# EAGLE board CFT-PB3 (EAGLE 5.11)
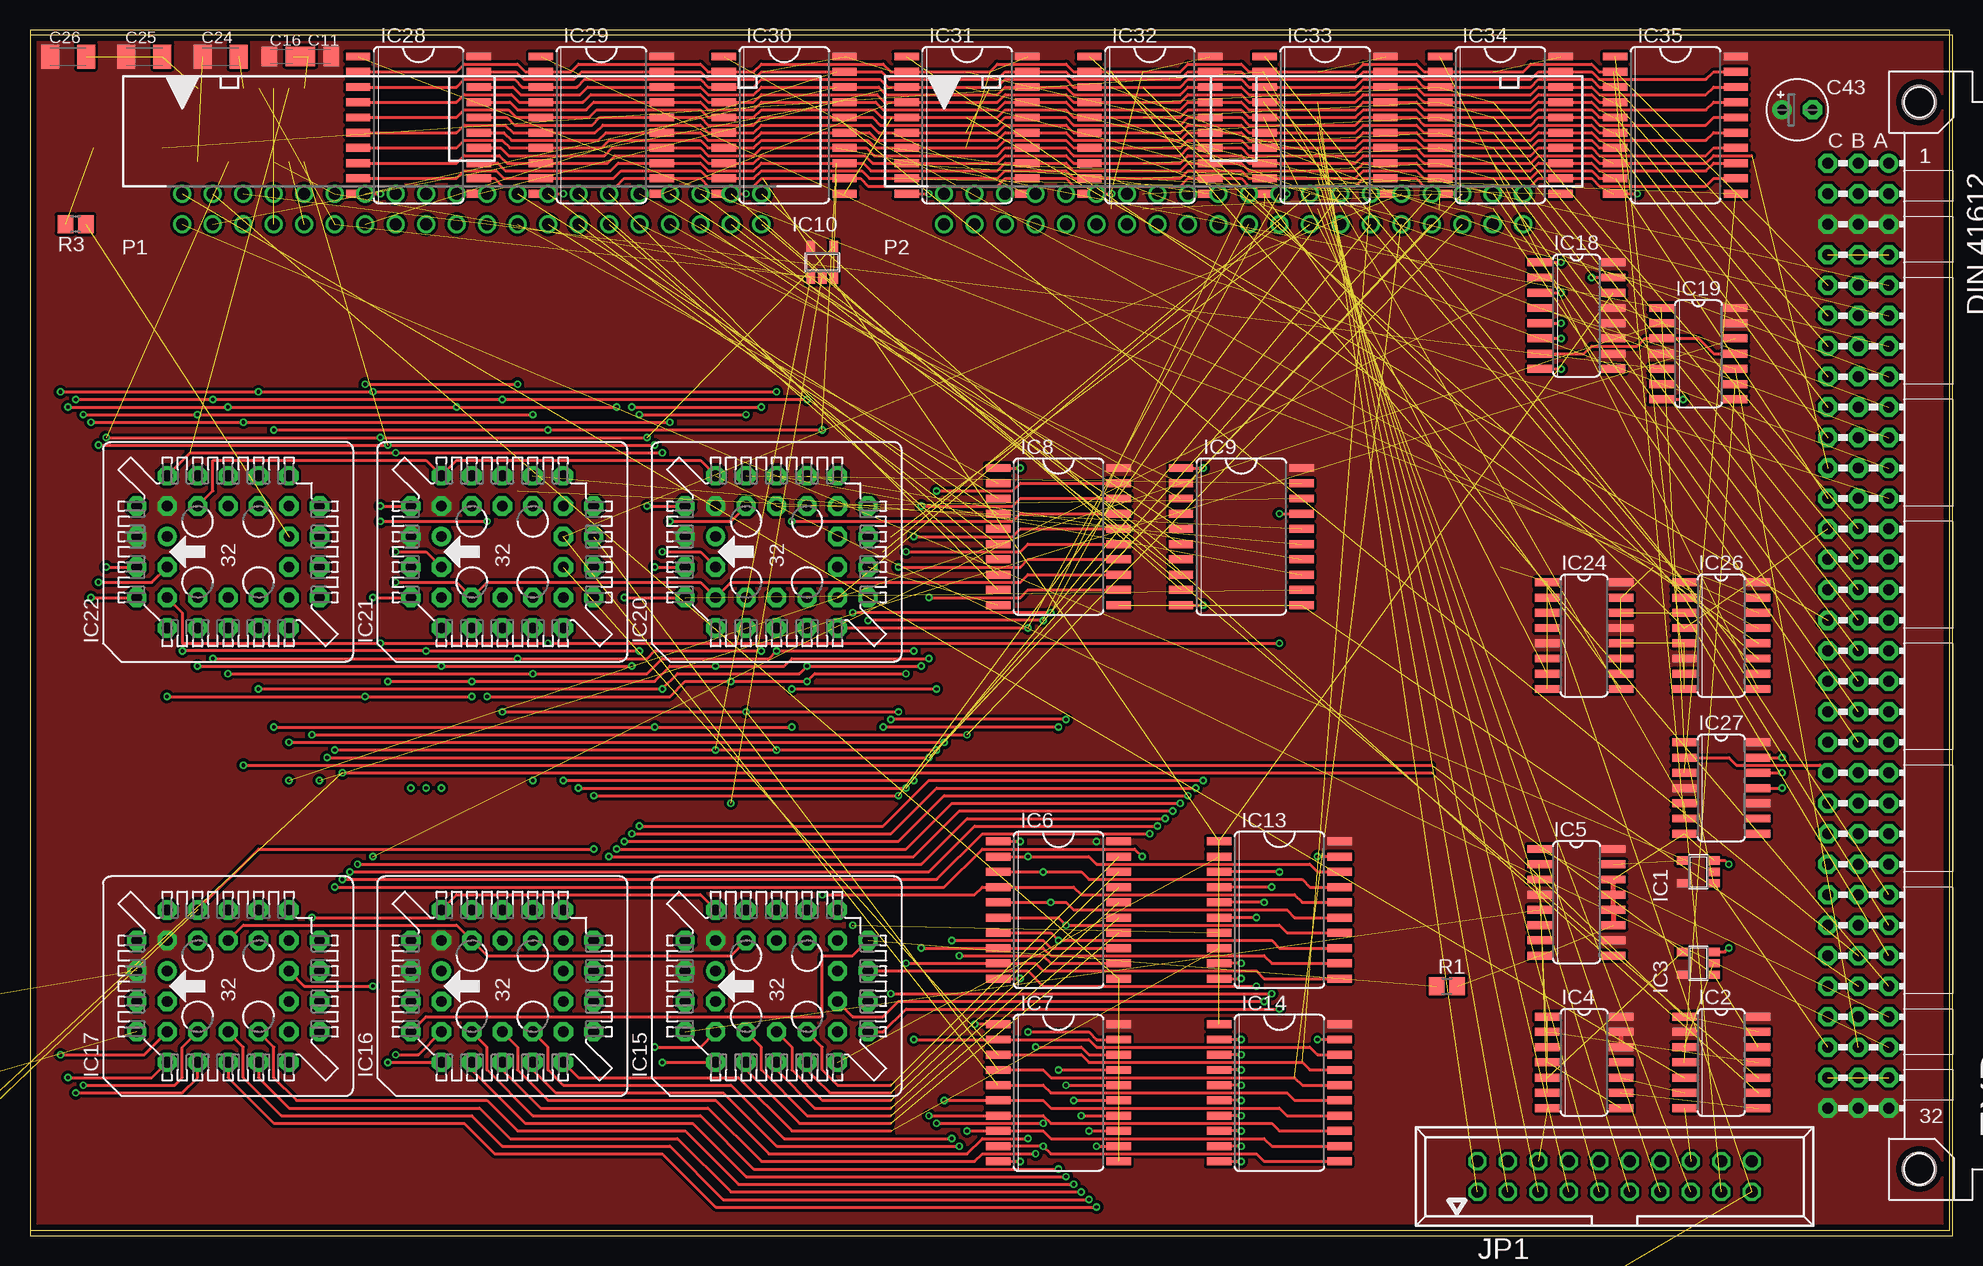
[diagram p8: board, top side]
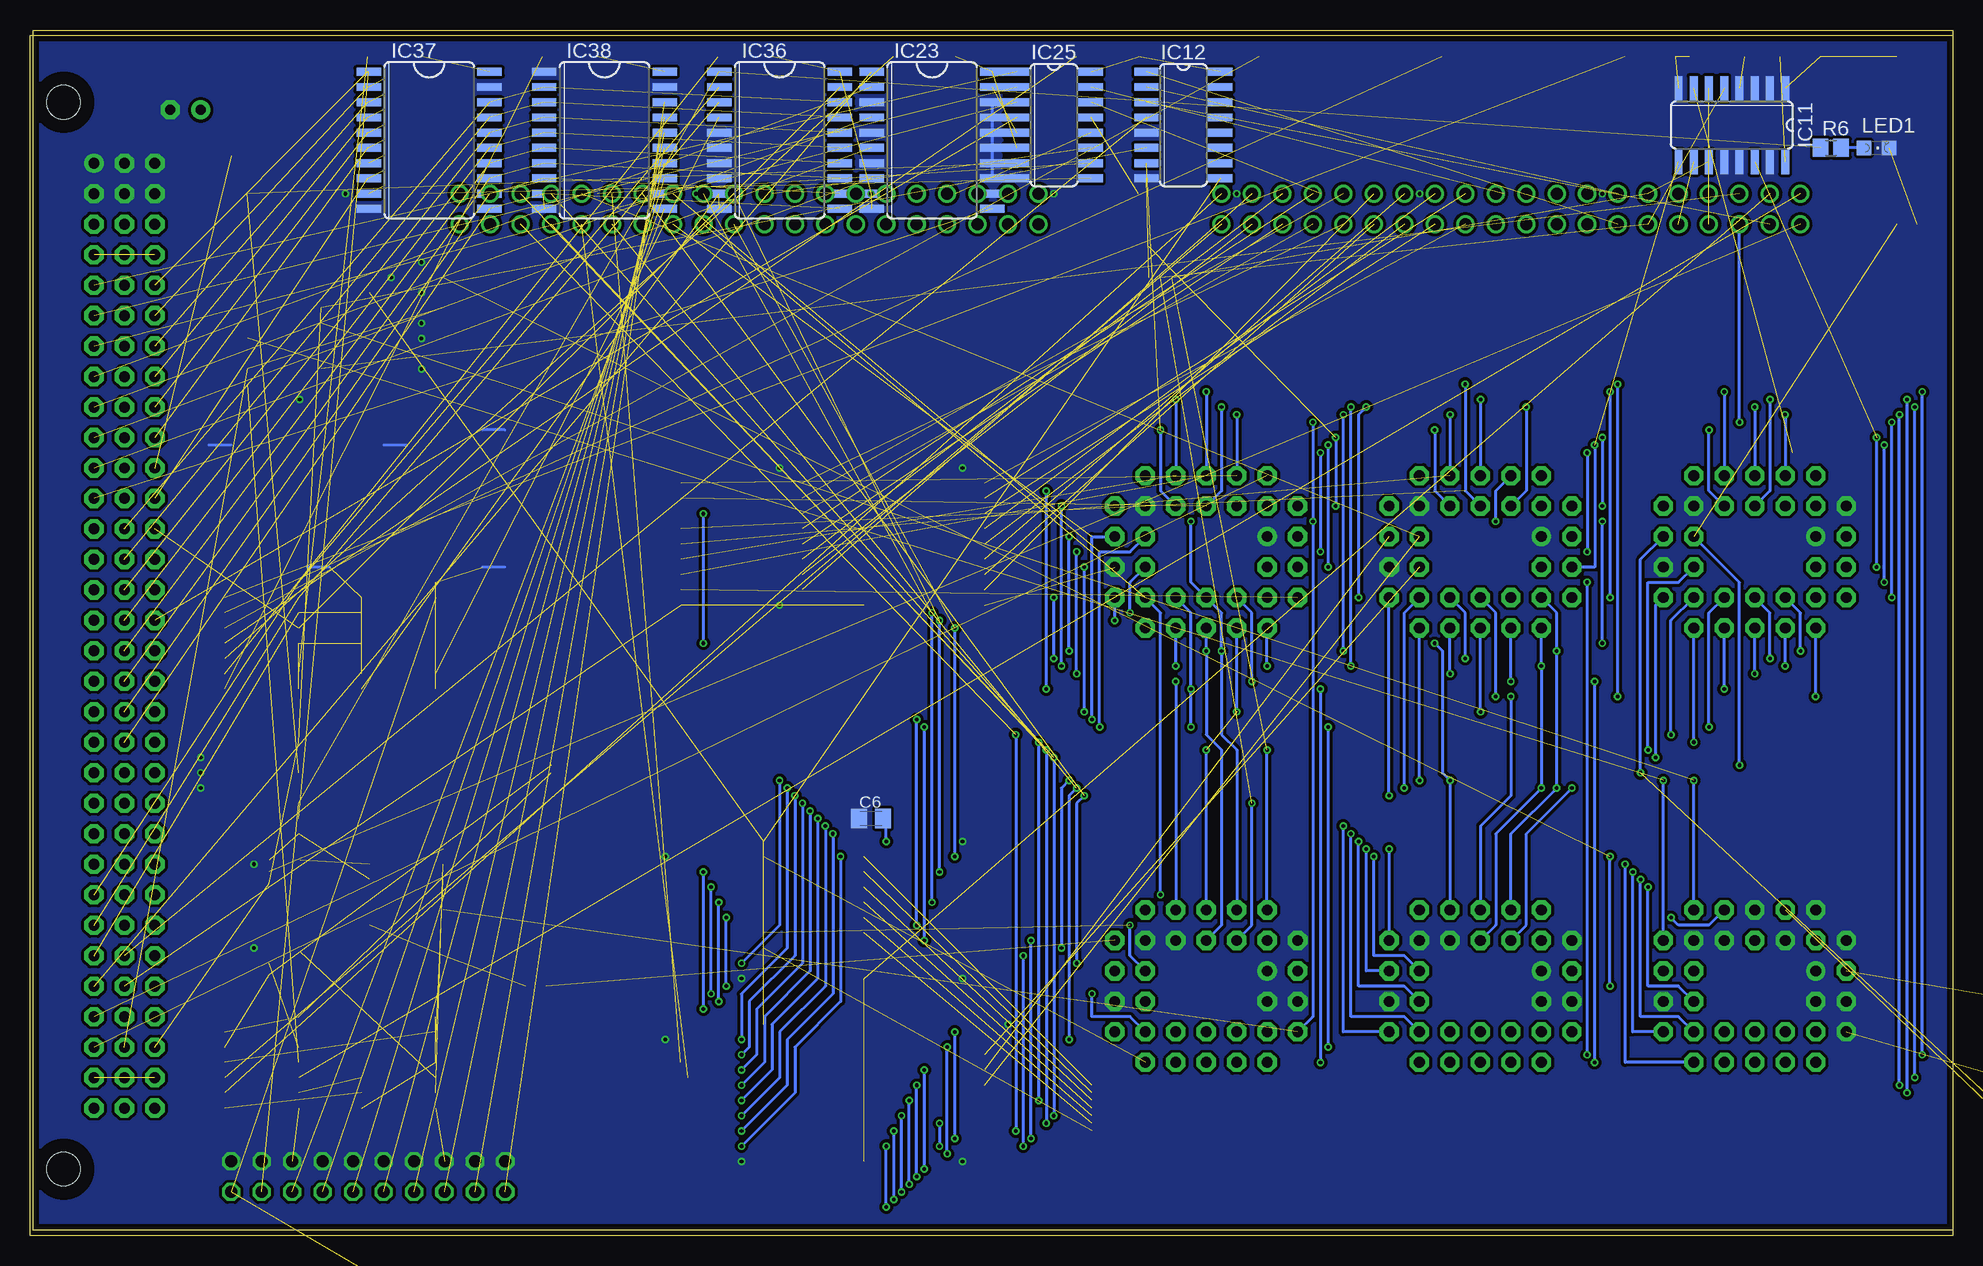
[diagram p9: board, bottom side, seen from below]

Size 160 x 100 mm. Coordinates in mm from the lower left corner, seen from the top.
Outline: 0,0 160,0 160,100 0,100 0,0
Copper layers (1*16): Top 0.035mm / dielectric 1.5mm / Bottom 0.035mm
Design rules "smart-prototyping": minimum track width 7mil, minimum drill 12mil, track to track 7mil, track to pad 7mil, pad to pad 7mil, via to via 7mil, smd to smd 0mil, copper to edge 20mil, drill to drill 10mil, minimum pad ring 10mil, minimum via ring 6mil, stop-mask expansion 2mil, vias tented up to drill 25mil, thermal gap 10mil
Net classes: 0 default: width 0.152 mm, clearance 0.152 mm; 1 low power: width 1.27 mm, clearance 0.254 mm; 2 LED power: width 1.93 mm, clearance 0.254 mm

## Footprints (pad centres in the part's own frame; a part is rotated, then mirrored left to right if it is on the bottom)
C0805K = smd 1.3 x 1.6: 1 -1,0; 2 1,0
C1206K = smd 1.5 x 2: 1 -1.5,0; 2 1.5,0
E2,5-5 = drill 0.813 pad 1.6 round: + -1.27,0 | drill 0.813 pad 1.6 octagon: - 1.27,0
VG96K = drill 0.914 pad 1.6 round: A1 154.94,39.37 | drill 0.914 pad 1.6 octagon: A2 154.94,36.83; A3 154.94,34.29; A4 154.94,31.75; A5 154.94,29.21; A6 154.94,26.67; A7 154.94,24.13; A8 154.94,21.59; A9 154.94,19.05; A10 154.94,16.51; A11 154.94,13.97; A12 154.94,11.43; A13 154.94,8.89; A14 154.94,6.35; A15 154.94,3.81; A16 154.94,1.27; A17 154.94,-1.27; A18 154.94,-3.81; A19 154.94,-6.35; A20 154.94,-8.89; A21 154.94,-11.43; A22 154.94,-13.97; A23 154.94,-16.51; A24 154.94,-19.05; A25 154.94,-21.59; A26 154.94,-24.13; A27 154.94,-26.67; A28 154.94,-29.21; A29 154.94,-31.75; A30 154.94,-34.29; A31 154.94,-36.83; A32 154.94,-39.37; B1 152.4,39.37; B2 152.4,36.83; B3 152.4,34.29; B4 152.4,31.75; B5 152.4,29.21; B6 152.4,26.67; B7 152.4,24.13; B8 152.4,21.59; B9 152.4,19.05; B10 152.4,16.51; B11 152.4,13.97; B12 152.4,11.43; B13 152.4,8.89; B14 152.4,6.35; B15 152.4,3.81; B16 152.4,1.27; B17 152.4,-1.27; B18 152.4,-3.81; B19 152.4,-6.35; B20 152.4,-8.89; B21 152.4,-11.43; B22 152.4,-13.97; B23 152.4,-16.51; B24 152.4,-19.05; B25 152.4,-21.59; B26 152.4,-24.13; B27 152.4,-26.67; B28 152.4,-29.21; B29 152.4,-31.75; B30 152.4,-34.29; B31 152.4,-36.83; B32 152.4,-39.37; C1 149.86,39.37; C2 149.86,36.83; C3 149.86,34.29; C4 149.86,31.75; C5 149.86,29.21; C6 149.86,26.67; C7 149.86,24.13; C8 149.86,21.59; C9 149.86,19.05; C10 149.86,16.51; C11 149.86,13.97; C12 149.86,11.43; C13 149.86,8.89; C14 149.86,6.35; C15 149.86,3.81; C16 149.86,1.27; C17 149.86,-1.27; C18 149.86,-3.81; C19 149.86,-6.35; C20 149.86,-8.89; C21 149.86,-11.43; C22 149.86,-13.97; C23 149.86,-16.51; C24 149.86,-19.05; C25 149.86,-21.59; C26 149.86,-24.13; C27 149.86,-26.67; C28 149.86,-29.21; C29 149.86,-31.75; C30 149.86,-34.29; C31 149.86,-36.83; C32 149.86,-39.37 | hole 2.794: 157.48,44.45; 157.48,-44.45
SOT23-5 = smd 0.69 x 0.99: 1 -0.95,-1.29; 2 0,-1.29; 3 0.95,-1.29; 4 0.95,1.3; 5 -0.95,1.3
SO14 = smd 0.66 x 2.032: 1 -3.81,-3.073; 2 -2.54,-3.073; 3 -1.27,-3.073; 4 0,-3.073; 5 1.27,-3.073; 6 2.54,-3.073; 7 3.81,-3.073; 8 3.81,3.073; 9 2.54,3.073; 10 1.27,3.073; 11 0,3.073; 12 -1.27,3.073; 13 -2.54,3.073; 14 -3.81,3.073
SO16 = smd 0.66 x 2.032: 1 -4.445,-3.073; 2 -3.175,-3.073; 3 -1.905,-3.073; 4 -0.635,-3.073; 5 0.635,-3.073; 6 1.905,-3.073; 7 3.175,-3.073; 8 4.445,-3.073; 9 4.445,3.073; 10 3.175,3.073; 11 1.905,3.073; 12 0.635,3.073; 13 -0.635,3.073; 14 -1.905,3.073; 15 -3.175,3.073; 16 -4.445,3.073
SO20W = smd 0.66 x 2.032: 1 -5.715,-5.029; 2 -4.445,-5.029; 3 -3.175,-5.029; 4 -1.905,-5.029; 5 -0.635,-5.029; 6 0.635,-5.029; 7 1.905,-5.029; 8 3.175,-5.029; 9 4.445,-5.029; 10 5.715,-5.029; 11 5.715,5.029; 12 4.445,5.029; 13 3.175,5.029; 14 1.905,5.029; 15 0.635,5.029; 16 -0.635,5.029; 17 -1.905,5.029; 18 -3.175,5.029; 19 -4.445,5.029; 20 -5.715,5.029
PLCC32 = drill 0.9 pad 1.6 round: 1 1.27,5.08 | drill 0.9 pad 1.6 octagon: 2 -1.27,7.62; 3 -1.27,5.08; 4 -3.81,7.62; 5 -6.35,5.08; 6 -3.81,5.08; 7 -6.35,2.54; 8 -3.81,2.54; 9 -6.35,0; 10 -3.81,0; 11 -6.35,-2.54; 12 -3.81,-2.54; 13 -6.35,-5.08; 14 -3.81,-7.62; 15 -3.81,-5.08; 16 -1.27,-7.62; 17 -1.27,-5.08; 18 1.27,-7.62; 19 1.27,-5.08; 20 3.81,-7.62; 21 6.35,-5.08; 22 3.81,-5.08; 23 6.35,-2.54; 24 3.81,-2.54; 25 6.35,0; 26 3.81,0; 27 6.35,2.54; 28 3.81,2.54; 29 6.35,5.08; 30 3.81,7.62; 31 3.81,5.08; 32 1.27,7.62
057-020-1 = drill 1 octagon: 1 -11.43,-1.27; 2 -11.43,1.27; 3 -8.89,-1.27; 4 -8.89,1.27; 5 -6.35,-1.27; 6 -6.35,1.27; 7 -3.81,-1.27; 8 -3.81,1.27; 9 -1.27,-1.27; 10 -1.27,1.27; 11 1.27,-1.27; 12 1.27,1.27; 13 3.81,-1.27; 14 3.81,1.27; 15 6.35,-1.27; 16 6.35,1.27; 17 8.89,-1.27; 18 8.89,1.27; 19 11.43,-1.27; 20 11.43,1.27
CHIPLED_0805 = smd 1.2 x 1.2: A 0,-1.05; C 0,1.05
PAK100/2500-5-40 = drill 1 pad 1.422 round: 1 -24.13,-1.27; 2 -24.13,1.27; 3 -21.59,-1.27; 4 -21.59,1.27; 5 -19.05,-1.27; 6 -19.05,1.27; 7 -16.51,-1.27; 8 -16.51,1.27; 9 -13.97,-1.27; 10 -13.97,1.27; 11 -11.43,-1.27; 12 -11.43,1.27; 13 -8.89,-1.27; 14 -8.89,1.27; 15 -6.35,-1.27; 16 -6.35,1.27; 17 -3.81,-1.27; 18 -3.81,1.27; 19 -1.27,-1.27; 20 -1.27,1.27; 21 1.27,-1.27; 22 1.27,1.27; 23 3.81,-1.27; 24 3.81,1.27; 25 6.35,-1.27; 26 6.35,1.27; 27 8.89,-1.27; 28 8.89,1.27; 29 11.43,-1.27; 30 11.43,1.27; 31 13.97,-1.27; 32 13.97,1.27; 33 16.51,-1.27; 34 16.51,1.27; 35 19.05,-1.27; 36 19.05,1.27; 37 21.59,-1.27; 38 21.59,1.27; 39 24.13,-1.27; 40 24.13,1.27
R0805 = smd 1.3 x 1.5: 1 -0.85,0; 2 0.85,0

## Placement (x,y rotation side)
$4_37_$  SIGNATURESILK  [SIGNATURE]  -228.6,-204.47 0 top  (outside the outline)
$4_39_$  OSHW-LOGOL  [OSHW-LOGO-L]  -215.26,-200.03 0 top  (outside the outline)
$4_39_$1  OSHW-LOGOL  [OSHW-LOGO-L]  -207.01,-200.03 0 top  (outside the outline)
$4_40_$  QRCODE-CFT  [CFT-QRCODE]  -228.6,-160.66 0 top  (outside the outline)
C1  0.1uF  [C0805K]  -217.81,-123.19 0 top  (outside the outline)
C2  0.1uF  [C0805K]  -211.46,-123.19 0 top  (outside the outline)
C3  0.1uF  [C0805K]  -217.81,-128.27 0 top  (outside the outline)
C4  0.1uF  [C0805K]  -211.46,-128.27 0 top  (outside the outline)
C5  1uF  [C0805K]  -217.81,-133.35 0 top  (outside the outline)
C6  0.1uF  [C0805K]  90.17,34.29 0 bottom
C7  0.1uF  [C0805K]  -217.81,-113.03 0 top  (outside the outline)
C8  0.1uF  [C0805K]  -211.46,-113.03 0 top  (outside the outline)
C9  0.1uF  [C0805K]  -217.81,-118.11 0 top  (outside the outline)
C10  1uF  [C0805K]  -211.46,-118.11 0 top  (outside the outline)
C11  0.1uF  [C0805K]  24.13,97.79 0 top
C12  0.1uF  [C0805K]  -216.53,-16.51 0 top  (outside the outline)
C13  0.1uF  [C0805K]  -215.9,-21.59 0 top  (outside the outline)
C14  0.1uF  [C0805K]  -215.9,-26.67 0 top  (outside the outline)
C15  0.1uF  [C0805K]  -217.17,-31.75 0 top  (outside the outline)
C16  1uF  [C0805K]  20.95,97.79 0 top
C17  1uF  [C1206K]  -217.81,-138.43 0 top  (outside the outline)
C18  1uF  [C1206K]  -222.88,-138.43 0 top  (outside the outline)
C19  1uF  [C1206K]  -227.97,-139.06 0 top  (outside the outline)
C20  0.1uF  [C0805K]  -217.17,-41.91 0 top  (outside the outline)
C21  0.1uF  [C0805K]  -210.82,-41.91 0 top  (outside the outline)
C22  0.1uF  [C0805K]  -217.17,-46.99 0 top  (outside the outline)
C23  1uF  [C0805K]  -210.82,-46.99 0 top  (outside the outline)
C24  1uF  [C1206K]  15.88,97.79 0 top
C25  1uF  [C1206K]  9.53,97.79 0 top
C26  1uF  [C1206K]  3.17,97.79 0 top
C27  0.1uF  [C0805K]  -217.81,-102.87 0 top  (outside the outline)
C28  0.1uF  [C0805K]  -216.53,-82.55 0 top  (outside the outline)
C29  0.1uF  [C0805K]  -217.17,-87.63 0 top  (outside the outline)
C30  0.1uF  [C0805K]  -217.17,-92.71 0 top  (outside the outline)
C31  0.1uF  [C0805K]  -217.17,-97.79 0 top  (outside the outline)
C32  0.1uF  [C0805K]  -216.53,-67.31 0 top  (outside the outline)
C33  0.1uF  [C0805K]  -210.82,-67.31 0 top  (outside the outline)
C34  0.1uF  [C0805K]  -217.17,-72.39 0 top  (outside the outline)
C35  0.1uF  [C0805K]  -210.82,-72.39 0 top  (outside the outline)
C36  0.1uF  [C0805K]  -217.17,-77.47 0 top  (outside the outline)
C37  0.1uF  [C0805K]  -217.17,-52.07 0 top  (outside the outline)
C38  0.1uF  [C0805K]  -210.82,-52.07 0 top  (outside the outline)
C39  0.1uF  [C0805K]  -217.17,-57.15 0 top  (outside the outline)
C40  0.1uF  [C0805K]  -210.82,-57.15 0 top  (outside the outline)
C41  0.1uF  [C0805K]  -217.17,-62.23 0 top  (outside the outline)
C42  1uF  [C0805K]  -210.82,-62.23 0 top  (outside the outline)
C43  1uF  [E2,5-5]  147.32,93.34 0 top
EXP  [VG96K]  0,49.53 0 top
IC1  74AHC1G08DBV  [SOT23-5]  139.06,29.84 90 top
IC2  74HC00D  [SO14]  140.97,13.97 270 top
IC3  74AHC1G08DBV  [SOT23-5]  139.06,22.23 90 top
IC4  74HC32D  [SO14]  129.54,13.97 270 top
IC5  74HC112D  [SO16]  128.91,27.3 270 top
IC6  74HC574D  [SO20W]  85.72,26.67 270 top
IC7  74HC574D  [SO20W]  85.72,11.43 270 top
IC8  74HC574D  [SO20W]  85.72,57.78 270 top
IC9  74HC574D  [SO20W]  100.97,57.78 270 top
IC10  74AHC1G32DBV  [SOT23-5]  66.04,80.64 0 top
IC11  74HC253D  [SO16]  18.41,92.08 180 bottom
IC12  74HC138D  [SO16]  64.14,92.08 270 bottom
IC13  74HC541DW  [SO20W]  104.14,26.67 270 top
IC14  74HC541DW  [SO20W]  104.14,11.43 270 top
IC15  29F040  [PLCC32]  62.23,20.32 90 top
IC16  29F040  [PLCC32]  39.37,20.32 90 top
IC17  29F040  [PLCC32]  16.51,20.32 90 top
IC18  74HC253D  [SO16]  128.91,76.2 270 top
IC19  74HC74D  [SO14]  139.06,73.03 270 top
IC20  29F040  [PLCC32]  62.23,56.52 90 top
IC21  29F040  [PLCC32]  39.37,56.52 90 top
IC22  29F040  [PLCC32]  16.51,56.52 90 top
IC23  74HC688DW  [SO20W]  85.09,90.81 270 bottom
IC24  74HC253D  [SO16]  129.54,49.53 270 top
IC25  74HC138D  [SO16]  74.93,92.08 270 bottom
IC26  74HC138D  [SO16]  140.97,49.53 270 top
IC27  74HC74D  [SO14]  140.97,36.83 270 top
IC28  74HC574D  [SO20W]  32.38,92.08 270 top
IC29  74HC574D  [SO20W]  47.62,92.08 270 top
IC30  74HC574D  [SO20W]  62.87,92.08 270 top
IC31  74HC574D  [SO20W]  78.11,92.08 270 top
IC32  74HC574D  [SO20W]  93.34,92.08 270 top
IC33  74HC574D  [SO20W]  107.95,92.08 270 top
IC34  74HC574D  [SO20W]  122.56,92.08 270 top
IC35  74HC574D  [SO20W]  137.16,92.08 270 top
IC36  74HC541DW  [SO20W]  97.79,90.81 270 bottom
IC37  74HC541DW  [SO20W]  127,90.81 270 bottom
IC38  74HC541DW  [SO20W]  112.39,90.81 270 bottom
JP1  057-020-1  [057-020-1]  132.08,4.45 0 top
LED1  LED-5MM-GREEN  [CHIPLED_0805]  6.35,90.17 270 bottom
P1  2540-5  [PAK100/2500-5-40]  36.83,85.09 0 top
P2  2540-5  [PAK100/2500-5-40]  100.33,85.09 0 top
R1  4k7  [R0805]  118.11,20.32 0 top
R2  4k7  [R0805]  -233.04,-217.17 0 top  (outside the outline)
R3  4k7  [R0805]  3.81,83.82 180 top
R4  4k7  [R0805]  -233.04,-203.2 0 top  (outside the outline)
R6  330R  [R0805]  10.16,90.17 0 bottom
R7  4k7  [R0805]  -233.04,-210.19 0 top  (outside the outline)

## Tracks (layer width: path | path; a pad name or v marks a point on that pad's centre or on a via)
!ALUCPL  (via drill 0.3)  (1 unrouted)
  Bottom 0.254: IC17.20 v24.13,37.47
!BANKING  (1 unrouted)
!BANKR0  (1 unrouted)
!BANKR1  (1 unrouted)
!BANKR2  (1 unrouted)
!BANKR3  (1 unrouted)
!BANKR4  (1 unrouted)
!BANKR5  (1 unrouted)
!BANKR6  (1 unrouted)
!BANKR7  (1 unrouted)
!BANKW0  (1 unrouted)
!BANKW1  (1 unrouted)
!BANKW2  (1 unrouted)
!BANKW3  (1 unrouted)
!BANKW4  (1 unrouted)
!BANKW5  (1 unrouted)
!BANKW6  (1 unrouted)
!BANKW7  (2 unrouted)
!BOE  (3 unrouted)
!CLL  (1 unrouted)
!CPL  (1 unrouted)
!DECCPL  (1 unrouted)
!FLTADD  (1 unrouted)
!FPRAM  (2 unrouted)
!INCCPL  (1 unrouted)
!IRQS  (1 unrouted)
  Top 0.254: IC20.29 55.88,64.14 35.56,64.14 IC21.29 33.02,64.14 15.24,64.14 15.24,61.59 IC22.28
!LCLR  (1 unrouted)
!MBUSEL  (1 unrouted)
!MEM  (2 unrouted)
!RESET  (4 unrouted)
!RSTHOLD  (1 unrouted)
!SYSDEV  (1 unrouted)
!T34  (1 unrouted)
!UOE  (via drill 0.3)  (1 unrouted)
  Top 0.254: v20.32,66.67 v43.18,66.67 v66.04,66.67
  Bottom 0.254: v20.32,66.67 20.32,61.59 IC22.24 | IC21.24 43.18,61.59 v43.18,66.67 | v66.04,66.67 66.04,61.59 IC20.24
!W  (1 unrouted)
!WALU  (2 unrouted)
+3.3V  (2 unrouted)
+12V  (2 unrouted)
A0  (via drill 0.3)
  Top 0.254: IC15.6 55.88,15.24 v52.07,15.24 | v63.5,41.91 v52.07,41.91 v20.32,41.91 | IC8.19 82.55,62.23 81.92,61.59 v75.56,61.59 | v63.5,45.09 v75.56,45.09
  Bottom 0.254: v52.07,41.91 v52.07,15.24 | v63.5,41.91 v63.5,45.09 63.5,51.44 IC20.12 | IC22.12 20.32,51.44 v20.32,41.91 | v75.56,45.09 v75.56,61.59
A1  (via drill 0.3)
  Top 0.254: v52.7,13.97 IC15.5 | v19.05,45.09 v52.7,45.09 53.98,46.35 64.14,46.35 v64.77,46.99 v74.3,46.99 | IC8.18 82.55,60.96 81.92,60.33 v74.3,60.33
  Bottom 0.254: v19.05,45.09 IC22.11 | v64.77,46.99 IC20.11 | v52.7,45.09 v52.7,13.97 | v74.3,46.99 v74.3,60.33
A2  (via drill 0.3)
  Top 0.254: v15.24,47.62 v40.64,47.62 51.44,47.62 52.07,48.26 v60.96,48.26 | IC8.17 82.55,59.69 81.92,59.05 v63.5,59.05
  Bottom 0.254: IC15.27 59.69,40.01 60.96,41.27 v60.96,48.26 60.96,51.44 IC20.10 63.5,53.98 v63.5,59.05 | v15.24,47.62 15.24,51.44 IC22.10 | IC21.12 40.64,51.44 v40.64,47.62
A3  (via drill 0.3)
  Top 0.254: v16.51,46.35 v41.91,46.35 51.44,46.35 52.7,47.62 61.59,47.62 v62.23,48.26 v73.66,48.26 | IC8.16 82.55,58.42 81.92,57.78 v73.66,57.78
  Bottom 0.254: IC15.26 60.96,25.4 60.96,40.01 62.23,41.27 v62.23,48.26 IC20.9 | v16.51,46.35 IC22.9 | v41.91,46.35 IC21.11 | v73.66,48.26 v73.66,57.78
A4  (via drill 0.3)
  Top 0.254: v38.1,44.45 53.34,44.45 54.61,45.72 v58.42,45.72 v64.77,45.72 65.41,46.35 v73.03,46.35 | IC8.15 83.19,57.15 82.55,56.52 v73.03,56.52
  Bottom 0.254: v64.77,45.72 IC15.23 | IC21.10 38.1,51.44 v38.1,44.45 | v58.42,45.72 58.42,51.44 IC20.8 | v73.03,46.35 v73.03,56.52
A5  (via drill 0.3)  (1 unrouted)
  Top 0.254: v39.37,43.18 v59.69,43.18 v72.39,43.18 | IC8.14 83.19,55.88 82.55,55.24 v72.39,55.24
  Bottom 0.254: IC15.25 v62.23,40.01 | v59.69,43.18 IC20.7 | v39.37,43.18 IC21.9 | v72.39,43.18 v72.39,55.24
A6  (via drill 0.3)
  Top 0.254: IC16.6 32.38,14.61 v30.48,14.61 | v30.48,53.98 35.56,53.98 IC21.8 38.1,53.98 55.88,53.98 IC20.6 58.42,53.98 82.55,53.98 83.19,54.61 IC8.13
  Bottom 0.254: v30.48,14.61 v30.48,53.98
A7  (via drill 0.3)
  Top 0.254: v29.84,13.97 IC16.5 | v29.84,45.72 v36.83,45.72 52.07,45.72 53.34,46.99 v57.15,46.99 62.87,46.99 63.5,47.62 v74.93,47.62 | IC8.12 83.19,53.34 82.55,52.7 v74.93,52.7
  Bottom 0.254: v29.84,13.97 v29.84,45.72 | v36.83,45.72 IC21.7 | v57.15,46.99 IC20.5 | v74.93,47.62 v74.93,52.7
A8  (via drill 0.3)  (1 unrouted)
  Top 0.254: v12.7,48.26 v33.02,48.26 v50.8,48.26 | v50.8,67.94 v59.69,67.94
  Bottom 0.254: IC16.27 36.83,33.02 v33.02,36.83 v33.02,48.26 33.02,51.44 IC21.6 | v12.7,48.26 12.7,51.44 IC22.8 | v50.8,48.26 v50.8,67.94 | v59.69,67.94 IC20.27
A9  (via drill 0.3)  (1 unrouted)
  Top 0.254: v13.97,46.99 v34.29,46.99 v50.16,46.99 | v50.16,68.58 v60.96,68.58
  Bottom 0.254: IC16.26 38.1,25.4 38.1,33.02 v34.29,36.83 v34.29,46.99 IC21.5 | v13.97,46.99 IC22.7 | IC20.26 60.96,61.59 v60.96,68.58 | v50.16,46.99 v50.16,68.58
A10  (via drill 0.3)
  Top 0.254: IC22.6 12.7,51.44 12.7,48.9 v29.21,48.9 v43.18,48.9 v104.14,48.9 | v29.21,59.05 v38.1,59.05 | v104.14,59.69 IC9.17
  Bottom 0.254: IC16.23 v41.91,37.47 42.55,38.1 42.55,48.26 v43.18,48.9 | v29.21,48.9 v29.21,59.05 | v38.1,59.05 38.1,61.59 IC21.27 | v104.14,48.9 v104.14,59.69
A11  (via drill 0.3)  (1 unrouted)
  Top 0.254: v11.43,44.45 v27.94,44.45 v36.83,44.45 | v27.94,70.48 v40.64,70.48
  Bottom 0.254: v11.43,44.45 IC22.5 | v36.83,44.45 36.83,36.2 39.37,33.66 IC16.25 | IC21.26 40.64,61.59 v40.64,70.48 | v27.94,44.45 v27.94,70.48
A12  (via drill 0.3)  (1 unrouted)
  Top 0.254: IC17.8 12.7,15.24 12.7,12.7 12.06,12.06 v4.45,12.06 | v4.45,67.94 v13.97,67.94 v41.91,67.94
  Bottom 0.254: v4.45,12.06 v4.45,67.94 | v13.97,67.94 IC22.27 | v41.91,67.94 IC21.23
A13  (via drill 0.3)  (1 unrouted)
  Top 0.254: IC17.7 13.97,12.7 12.7,11.43 v3.81,11.43 | v3.81,69.22 v15.24,69.22 v39.37,69.22 v64.77,69.22
  Bottom 0.254: v3.81,11.43 v3.81,69.22 | v15.24,69.22 15.24,61.59 IC22.26 | v39.37,69.22 IC21.25 | v64.77,69.22 IC20.23
A14  (via drill 0.3)  (1 unrouted)
  Top 0.254: IC17.6 9.53,14.61 v2.54,14.61 | v62.23,69.85 v28.57,69.85 v19.05,69.85 v2.54,69.85 | v28.57,52.7 IC21.4
  Bottom 0.254: v19.05,69.85 IC22.23 | v2.54,14.61 v2.54,69.85 | v62.23,69.85 IC20.25 | v28.57,69.85 v28.57,52.7
A15  (via drill 0.3)  (1 unrouted)
  Top 0.254: IC17.5 10.16,12.7 v3.17,12.7 | v3.17,68.58 v16.51,68.58 v35.56,68.58 v48.9,68.58 | v49.53,52.7 IC20.4
  Bottom 0.254: v3.17,12.7 v3.17,68.58 | v16.51,68.58 IC22.25 | v35.56,68.58 35.56,61.59 IC21.28 | v48.9,68.58 49.53,67.94 v49.53,52.7
AB0  (1 unrouted)
AB1  (1 unrouted)
AB2  (1 unrouted)
AB3  (1 unrouted)
AB4  (1 unrouted)
AB5  (1 unrouted)
AB6  (1 unrouted)
AB7  (1 unrouted)
AB13  (2 unrouted)
AB14  (2 unrouted)
AB15  (2 unrouted)
AC0  (1 unrouted)
AC1  (1 unrouted)
AC2  (1 unrouted)
AC3  (1 unrouted)
AC4  (1 unrouted)
AC5  (1 unrouted)
AC6  (1 unrouted)
AC7  (1 unrouted)
AC8  (1 unrouted)
AC9  (1 unrouted)
AC10  (1 unrouted)
AC11  (1 unrouted)
AC12  (1 unrouted)
AC13  (1 unrouted)
AC14  (1 unrouted)
AC15  (1 unrouted)
AE'0  (1 unrouted)
  Top 0.254: IC28.19 40.51,96.52 41.15,95.89 45.34,95.89 45.97,96.52 IC29.19 55.88,96.52 56.52,95.89 60.33,95.89 60.96,96.52 IC30.19 70.99,96.52 71.63,95.89 80.64,95.89 81.28,96.52 IC31.19 86.36,96.52 87,95.89 95.89,95.89 96.52,96.52 IC32.19 100.97,96.52 101.6,95.89 110.49,95.89 111.12,96.52 IC33.19 115.57,96.52 116.2,95.89 125.09,95.89 125.73,96.52 IC34.19 130.18,96.52 130.81,95.89 139.7,95.89 140.34,96.52 IC35.19
AE'1  (1 unrouted)
  Top 0.254: IC28.18 40.26,95.25 40.89,94.61 45.85,94.61 46.48,95.25 IC29.18 55.88,95.25 56.52,94.61 60.33,94.61 60.96,95.25 IC30.18 70.74,95.25 71.37,94.61 80.64,94.61 81.28,95.25 IC31.18 86.36,95.25 87,94.61 95.89,94.61 96.52,95.25 IC32.18 100.97,95.25 101.6,94.61 110.49,94.61 111.12,95.25 IC33.18 115.57,95.25 116.2,94.61 125.09,94.61 125.73,95.25 IC34.18 130.18,95.25 130.81,94.61 139.7,94.61 140.34,95.25 IC35.18
AE'2  (1 unrouted)
  Top 0.254: IC28.17 40.01,93.98 40.64,93.34 46.35,93.34 46.99,93.98 IC29.17 55.88,93.98 56.52,93.34 60.33,93.34 60.96,93.98 IC30.17 70.48,93.98 71.12,93.34 80.64,93.34 81.28,93.98 IC31.17 86.36,93.98 87,93.34 95.89,93.34 96.52,93.98 IC32.17 100.97,93.98 101.6,93.34 110.49,93.34 111.12,93.98 IC33.17 115.57,93.98 116.2,93.34 125.09,93.34 125.73,93.98 IC34.17 130.18,93.98 130.81,93.34 139.7,93.34 140.34,93.98 IC35.17
AE'3  (1 unrouted)
  Top 0.254: IC28.16 39.75,92.71 40.39,92.08 46.86,92.08 47.5,92.71 IC29.16 55.88,92.71 56.52,92.08 60.33,92.08 60.96,92.71 IC30.16 70.23,92.71 70.87,92.08 80.64,92.08 81.28,92.71 IC31.16 86.36,92.71 87,92.08 95.89,92.08 96.52,92.71 IC32.16 100.97,92.71 101.6,92.08 110.49,92.08 111.12,92.71 IC33.16 115.57,92.71 116.2,92.08 125.09,92.08 125.73,92.71 IC34.16 130.18,92.71 130.81,92.08 139.7,92.08 140.34,92.71 IC35.16
AE'4  (1 unrouted)
  Top 0.254: IC28.15 39.5,91.44 40.13,90.81 47.37,90.81 48.01,91.44 IC29.15 55.88,91.44 56.52,90.81 60.33,90.81 60.96,91.44 IC30.15 69.98,91.44 70.61,90.81 80.64,90.81 81.28,91.44 IC31.15 86.36,91.44 87,90.81 95.89,90.81 96.52,91.44 IC32.15 100.97,91.44 101.6,90.81 110.49,90.81 111.12,91.44 IC33.15 115.57,91.44 116.2,90.81 125.09,90.81 125.73,91.44 IC34.15 130.18,91.44 130.81,90.81 139.7,90.81 140.34,91.44 IC35.15
AE'5  (1 unrouted)
  Top 0.254: IC28.14 39.24,90.17 39.88,89.53 47.88,89.53 48.51,90.17 IC29.14 55.88,90.17 56.52,89.53 60.33,89.53 60.96,90.17 IC30.14 69.72,90.17 70.36,89.53 80.64,89.53 81.28,90.17 IC31.14 86.36,90.17 87,89.53 95.89,89.53 96.52,90.17 IC32.14 100.97,90.17 101.6,89.53 110.49,89.53 111.12,90.17 IC33.14 115.57,90.17 116.2,89.53 125.09,89.53 125.73,90.17 IC34.14 130.18,90.17 130.81,89.53 139.7,89.53 140.34,90.17 IC35.14
AE'6  (1 unrouted)
  Top 0.254: IC28.13 38.99,88.9 39.62,88.27 48.39,88.27 49.02,88.9 IC29.13 55.88,88.9 56.52,88.27 60.33,88.27 60.96,88.9 IC30.13 69.47,88.9 70.1,88.27 80.64,88.27 81.28,88.9 IC31.13 86.36,88.9 87,88.27 95.89,88.27 96.52,88.9 IC32.13 100.97,88.9 101.6,88.27 110.49,88.27 111.12,88.9 IC33.13 115.57,88.9 116.2,88.27 125.09,88.27 125.73,88.9 IC34.13 130.18,88.9 130.81,88.27 139.7,88.27 140.34,88.9 IC35.13
AE'7  (1 unrouted)
  Top 0.254: IC28.12 38.73,87.63 39.37,87 48.9,87 49.53,87.63 IC29.12 55.88,87.63 56.52,87 60.33,87 60.96,87.63 IC30.12 69.22,87.63 69.85,87 80.64,87 81.28,87.63 IC31.12 86.36,87.63 87,87 95.89,87 96.52,87.63 IC32.12 100.97,87.63 101.6,87 110.49,87 111.12,87.63 IC33.12 115.57,87.63 116.2,87 125.09,87 125.73,87.63 IC34.12 130.18,87.63 130.81,87 139.7,87 140.34,87.63 IC35.12
AEXT0  (3 unrouted)
AEXT1  (3 unrouted)
AEXT2  (3 unrouted)
AEXT3  (3 unrouted)
AEXT4  (3 unrouted)
AEXT5  (3 unrouted)
AEXT6  (3 unrouted)
AEXT7  (3 unrouted)
B0  (1 unrouted)
  Top 0.254: IC15.12 66.04,15.24 66.04,13.34 67.31,12.06 71.75,12.06
B1  (1 unrouted)
  Top 0.254: IC15.11 64.77,13.34 65.41,12.7 66.67,11.43 71.75,11.43
B2  (1 unrouted)
  Top 0.254: IC15.10 63.5,15.24 63.5,13.34 66.04,10.79 71.75,10.79
B3  (1 unrouted)
  Top 0.254: IC15.9 62.23,13.34 65.41,10.16 71.75,10.16
B4  (1 unrouted)
  Top 0.254: IC15.8 60.96,15.24 60.96,13.34 64.77,9.53 71.75,9.53
B5  (1 unrouted)
  Top 0.254: IC15.7 59.69,13.34 64.14,8.89 71.75,8.89
B6  (via drill 0.3)
  Top 0.254: IC16.12 43.18,15.24 43.18,13.34 44.45,12.06 58.42,12.06 62.87,7.62 v76.83,7.62 | v76.83,24.13 84.45,24.13 85.09,23.5 IC6.13
  Bottom 0.254: v76.83,7.62 v76.83,24.13
B7  (via drill 0.3)
  Top 0.254: IC16.11 41.91,13.34 43.81,11.43 57.78,11.43 62.23,6.99 v77.47,6.99 | v77.47,22.86 84.45,22.86 85.09,22.23 IC6.12
  Bottom 0.254: v77.47,6.99 v77.47,22.86
B8  (via drill 0.3)
  Top 0.254: IC16.10 40.64,15.24 40.64,13.34 43.18,10.79 57.15,10.79 61.59,6.35 78.11,6.35 79.38,7.62 v83.19,7.62 | v83.19,16.51 88.27,16.51 88.9,15.88 IC7.19
  Bottom 0.254: v83.19,7.62 v83.19,16.51
B9  (via drill 0.3)
  Top 0.254: IC16.9 39.37,13.34 42.55,10.16 56.52,10.16 60.96,5.71 78.74,5.71 79.38,6.35 v83.82,6.35 | v83.82,15.24 87.63,15.24 88.27,14.61 IC7.18
  Bottom 0.254: v83.82,6.35 v83.82,15.24
B10  (via drill 0.3)
  Top 0.254: IC16.8 38.1,15.24 38.1,13.34 41.91,9.53 55.88,9.53 60.33,5.08 v85.72,5.08 | v85.72,13.34 IC7.17
  Bottom 0.254: v85.72,5.08 v85.72,13.34
B11  (via drill 0.3)
  Top 0.254: IC16.7 36.83,13.34 41.27,8.89 55.24,8.89 59.69,4.45 v86.36,4.45 | v86.36,12.06 IC7.16
  Bottom 0.254: v86.36,4.45 v86.36,12.06
B12  (via drill 0.3)
  Top 0.254: IC17.12 20.32,15.24 20.32,12.7 22.23,10.79 38.1,10.79 40.64,8.26 54.61,8.26 59.05,3.81 v87,3.81 | v87,10.79 IC7.15
  Bottom 0.254: v87,3.81 v87,10.79
B13  (via drill 0.3)
  Top 0.254: IC17.11 19.05,12.7 21.59,10.16 37.47,10.16 40.01,7.62 53.98,7.62 58.42,3.17 v87.63,3.17 | v87.63,9.53 IC7.14
  Bottom 0.254: v87.63,3.17 v87.63,9.53
B14  (via drill 0.3)
  Top 0.254: IC17.10 17.78,15.24 17.78,12.7 20.95,9.53 36.83,9.53 39.37,6.99 53.34,6.99 57.78,2.54 v88.27,2.54 | v88.27,8.26 IC7.13
  Bottom 0.254: v88.27,2.54 v88.27,8.26
B15  (via drill 0.3)
  Top 0.254: IC17.9 16.51,12.7 20.32,8.89 36.2,8.89 38.73,6.35 52.7,6.35 57.15,1.91 v88.9,1.91 | v88.9,6.99 IC7.12
  Bottom 0.254: v88.9,1.91 v88.9,6.99
BANK0  (1 unrouted)
BANK1  (1 unrouted)
BANK2  (1 unrouted)
BANK3  (1 unrouted)
BANK4  (1 unrouted)
BANK5  (1 unrouted)
BANK6  (1 unrouted)
BANK7  (1 unrouted)
BANKING  (3 unrouted)
CLK1  (1 unrouted)
CLK3  (2 unrouted)
CLK4  (2 unrouted)
CO1  (1 unrouted)
  Top 0.254: IC15.20 68.58,22.86 66.04,22.86 66.04,17.78 33.02,17.78 IC16.4
CO2  (via drill 0.3)  (1 unrouted)
  Top 0.254: IC17.27 19.05,31.75 v46.99,31.75
  Bottom 0.254: v46.99,31.75 IC16.20
DB0  (1 unrouted)
  Top 0.254: IC28.2 35.56,96.52 36.2,97.16 40.64,97.16 41.27,96.52 IC29.2 45.09,96.52 45.72,97.16 55.88,97.16 56.52,96.52 IC30.2 60.33,96.52 60.96,97.16 71.12,97.16 71.75,96.52 IC31.2 80.01,96.52 80.64,97.16 86.36,97.16 87,96.52 IC32.2 95.89,96.52 96.52,97.16 100.97,97.16 101.6,96.52 IC33.2 110.49,96.52 111.12,97.16 115.57,97.16 116.2,96.52 IC34.2 124.46,96.52 125.09,97.16 130.18,97.16 130.81,96.52 IC35.2
DB1  (1 unrouted)
  Top 0.254: IC28.3 35.56,95.25 36.2,95.89 40.39,95.89 41.02,95.25 IC29.3 45.59,95.25 46.23,95.89 55.88,95.89 56.52,95.25 IC30.3 60.33,95.25 60.96,95.89 70.87,95.89 71.5,95.25 IC31.3 80.64,95.25 81.28,95.89 86.36,95.89 87,95.25 IC32.3 95.89,95.25 96.52,95.89 100.97,95.89 101.6,95.25 IC33.3 110.49,95.25 111.12,95.89 115.57,95.89 116.2,95.25 IC34.3 125.09,95.25 125.73,95.89 130.18,95.89 130.81,95.25 IC35.3
DB2  (1 unrouted)
  Top 0.254: IC28.4 35.56,93.98 36.2,94.61 40.13,94.61 40.77,93.98 IC29.4 46.1,93.98 46.74,94.61 55.88,94.61 56.52,93.98 IC30.4 60.33,93.98 60.96,94.61 70.61,94.61 71.25,93.98 IC31.4 80.64,93.98 81.28,94.61 86.36,94.61 87,93.98 IC32.4 95.89,93.98 96.52,94.61 100.97,94.61 101.6,93.98 IC33.4 110.49,93.98 111.12,94.61 115.57,94.61 116.2,93.98 IC34.4 125.09,93.98 125.73,94.61 130.18,94.61 130.81,93.98 IC35.4
DB3  (1 unrouted)
  Top 0.254: IC28.5 35.56,92.71 36.2,93.34 39.88,93.34 40.51,92.71 IC29.5 46.61,92.71 47.24,93.34 55.88,93.34 56.52,92.71 IC30.5 60.33,92.71 60.96,93.34 70.36,93.34 70.99,92.71 IC31.5 80.64,92.71 81.28,93.34 86.36,93.34 87,92.71 IC32.5 95.89,92.71 96.52,93.34 100.97,93.34 101.6,92.71 IC33.5 110.49,92.71 111.12,93.34 115.57,93.34 116.2,92.71 IC34.5 125.09,92.71 125.73,93.34 130.18,93.34 130.81,92.71 IC35.5
DB4  (1 unrouted)
  Top 0.254: IC28.6 35.56,91.44 36.2,92.08 39.62,92.08 40.26,91.44 IC29.6 47.12,91.44 47.75,92.08 55.88,92.08 56.52,91.44 IC30.6 60.33,91.44 60.96,92.08 70.1,92.08 70.74,91.44 IC31.6 80.64,91.44 81.28,92.08 86.36,92.08 87,91.44 IC32.6 95.89,91.44 96.52,92.08 100.97,92.08 101.6,91.44 IC33.6 110.49,91.44 111.12,92.08 115.57,92.08 116.2,91.44 IC34.6 125.09,91.44 125.73,92.08 130.18,92.08 130.81,91.44 IC35.6
DB5  (1 unrouted)
  Top 0.254: IC28.7 35.56,90.17 36.2,90.81 39.37,90.81 40.01,90.17 IC29.7 47.62,90.17 48.26,90.81 55.88,90.81 56.52,90.17 IC30.7 60.33,90.17 60.96,90.81 69.85,90.81 70.48,90.17 IC31.7 80.64,90.17 81.28,90.81 86.36,90.81 87,90.17 IC32.7 95.89,90.17 96.52,90.81 100.97,90.81 101.6,90.17 IC33.7 110.49,90.17 111.12,90.81 115.57,90.81 116.2,90.17 IC34.7 125.09,90.17 125.73,90.81 130.18,90.81 130.81,90.17 IC35.7
DB6  (1 unrouted)
  Top 0.254: IC28.8 35.56,88.9 36.2,89.53 39.12,89.53 39.75,88.9 IC29.8 48.13,88.9 48.77,89.53 55.88,89.53 56.52,88.9 IC30.8 60.33,88.9 60.96,89.53 69.6,89.53 70.23,88.9 IC31.8 80.64,88.9 81.28,89.53 86.36,89.53 87,88.9 IC32.8 95.89,88.9 96.52,89.53 100.97,89.53 101.6,88.9 IC33.8 110.49,88.9 111.12,89.53 115.57,89.53 116.2,88.9 IC34.8 125.09,88.9 125.73,89.53 130.18,89.53 130.81,88.9 IC35.8 139.7,88.9 140.34,89.53 143.51,89.53
DB7  (1 unrouted)
  Top 0.254: IC28.9 35.56,87.63 36.2,88.27 38.86,88.27 39.5,87.63 IC29.9 48.64,87.63 49.28,88.27 55.88,88.27 56.52,87.63 IC30.9 60.33,87.63 60.96,88.27 69.34,88.27 69.98,87.63 IC31.9 80.64,87.63 81.28,88.27 86.36,88.27 87,87.63 IC32.9 95.89,87.63 96.52,88.27 100.97,88.27 101.6,87.63 IC33.9 110.49,87.63 111.12,88.27 115.57,88.27 116.2,87.63 IC34.9 125.09,87.63 125.73,88.27 130.18,88.27 130.81,87.63 IC35.9
DB8
  Top 0.254: IC27.2 141.6,39.37 142.24,38.73 149.22,38.73 EXP.C21
FL  (via drill 0.3)  (1 unrouted)
  Top 0.254: v53.34,59.05 58.42,59.05 IC20.28 | v5.08,52.7 IC22.4 | v5.08,67.31 v17.78,67.31 v53.34,67.31
  Bottom 0.254: IC15.4 53.34,17.78 v53.34,59.05 v53.34,67.31 | v5.08,52.7 v5.08,67.31 | v17.78,67.31 P1.5
FLAGCLK
  Top 0.254: IC18.7 129.54,73.03 130.18,73.66 133.99,73.66 134.62,74.3 IC19.3 139.06,74.3 140.34,73.03 IC19.11
FLATCH  (via drill 0.3)  (1 unrouted)
  Top 0.254: IC17.19 22.86,20.32 v28.57,20.32
  Bottom 0.254: v28.57,20.32 v28.57,31.11
FV  (1 unrouted)
FVOUT  (via drill 0.3)  (1 unrouted)
  Bottom 0.254: IC17.21 v21.59,37.47
GND  (via drill 0.3)  (64 unrouted)
  Top 0.254: IC28.10 v29.21,86.36 | IC29.10 v44.45,86.36 | IC30.10 v59.69,86.36 | IC31.10 v74.93,86.36 | IC32.10 v90.17,86.36 | IC34.10 v119.38,86.36 | IC35.10 v133.99,86.36 | IC7.10 v82.55,5.71 | IC14.10 v100.97,5.71 | IC14.19 v107.31,15.88 | IC13.10 v100.97,20.95 | IC6.10 v82.55,20.95 | IC7.1 v78.74,17.14 | IC13.19 v107.31,31.11 | IC6.1 v82.55,32.38 | IC9.10 v97.79,52.07 | IC8.1 v82.55,63.5 | IC9.1 v97.79,63.5 | IC33.10 v104.78,86.36 | IC3.3 141.28,23.18 v141.6,23.5 | IC1.3 141.29,30.8 v141.6,30.48 | IC18.5 v127.64,75.56 | IC18.8 v127.64,71.75 | IC19.7 v137.79,69.22 | IC18.1 v127.64,80.64 | IC18.3 v127.64,78.11 | IC18.15 v130.18,79.38 | IC18.6 v127.64,74.3 | IC27.13 v146.05,39.37 | IC27.12 v146.05,38.1 | IC27.11 v146.05,36.83
  Top 0.406: IC5.14 IC5.13 IC5.12 IC5.11
  Bottom 0.254: 135.31,55.24 137.16,55.24 | 143.51,65.41 145.36,65.41 | 120.7,66.67 122.56,66.67 | 120.7,55.24 122.56,55.24 | 128.91,65.41 130.76,65.41 | IC23.18 IC23.17 IC23.16 IC23.15 IC23.14 IC23.13
  pour Bottom (isolate 0.254, rank 6, no thermals): 0,99.69 0,-0.64 160.66,-0.64 160.66,99.69
HWA2  (1 unrouted)
HWA7  (1 unrouted)
IBUS0  (via drill 0.3)  (1 unrouted)
  Top 0.254: IC13.18 107.31,29.84 106.68,30.48 88.9,30.48 88.27,31.11 v83.19,31.11 IC6.2 | v83.19,50.16 IC20.13
  Bottom 0.254: v83.19,31.11 v83.19,50.16
IBUS1  (via drill 0.3)  (1 unrouted)
  Top 0.254: IC6.3 v84.45,29.84 87.63,29.84 88.27,29.21 106.05,29.21 106.68,28.57 IC13.17 | v84.45,50.8 v69.85,50.8
  Bottom 0.254: v69.85,50.8 IC20.14 | v84.45,29.84 v84.45,50.8
IBUS2  (via drill 0.3)  (1 unrouted)
  Top 0.254: IC13.16 106.05,27.3 105.41,27.94 87.63,27.94 87,28.57 IC6.4 79.38,28.57 78.74,27.94 v66.04,27.94
  Bottom 0.254: IC20.15 66.04,51.44 v66.04,27.94
IBUS3  (via drill 0.3)  (1 unrouted)
  Top 0.254: IC6.5 v85.09,27.3 86.36,27.3 87,26.67 104.78,26.67 105.41,26.04 IC13.15 | v85.09,51.44 v68.58,51.44
  Bottom 0.254: IC20.17 68.58,53.98 v68.58,51.44 | v85.09,27.3 v85.09,51.44
IBUS4  (via drill 0.3)  (1 unrouted)
  Top 0.254: IC6.6 85.72,26.04 v86.36,25.4 104.14,25.4 104.78,24.77 IC13.14 | v86.36,42.55 v71.75,42.55
  Bottom 0.254: v86.36,25.4 v86.36,42.55 | IC20.18 71.75,57.78 v71.75,42.55
IBUS5  (via drill 0.3)  (1 unrouted)
  Top 0.254: IC6.7 85.09,24.77 v85.72,24.13 103.5,24.13 104.14,23.5 IC13.13 | v85.72,41.91 v71.12,41.91
  Bottom 0.254: v85.72,24.13 v85.72,41.91 | v71.12,41.91 71.12,56.52 68.58,56.52 IC20.19
IBUS6  (via drill 0.3)
  Top 0.254: IC13.12 103.5,22.23 102.87,22.86 85.09,22.86 84.45,23.5 IC6.8 v74.3,23.5 | v44.45,37.47 v73.66,37.47
  Bottom 0.254: v44.45,37.47 IC21.13 | v73.66,37.47 74.3,36.83 v74.3,23.5
IBUS7  (via drill 0.3)  (1 unrouted)
  Top 0.254: IC13.11 102.87,20.95 102.23,21.59 84.45,21.59 83.82,22.23 IC6.9 v73.03,22.23 | v46.99,36.2 v72.39,36.2
  Bottom 0.254: v46.99,36.2 IC21.14 | v72.39,36.2 73.03,35.56 v73.03,22.23
IBUS8  (via drill 0.3)  (1 unrouted)
  Top 0.254: IC14.18 107.31,14.61 106.68,15.24 88.9,15.24 88.27,15.88 IC7.2 v73.66,15.88 | v45.72,36.83 v73.03,36.83
  Bottom 0.254: IC21.15 45.72,51.44 v45.72,36.83 | v73.03,36.83 73.66,36.2 v73.66,15.88
IBUS9  (2 unrouted)
  Top 0.254: IC7.3 87.63,14.61 88.27,13.97 106.05,13.97 106.68,13.34 IC14.17
IBUS10  (2 unrouted)
  Top 0.254: IC14.16 106.05,12.06 105.41,12.7 85.09,12.7 84.45,13.34 IC7.4
IBUS11  (2 unrouted)
  Top 0.254: IC7.5 84.45,12.06 85.09,11.43 104.78,11.43 105.41,10.79 IC14.15
IBUS12  (via drill 0.3)  (1 unrouted)
  Top 0.254: IC14.14 104.78,9.53 104.14,10.16 85.09,10.16 84.45,10.79 IC7.6 v76.2,10.79 | v21.59,40.64 v76.2,40.64
  Bottom 0.254: v21.59,40.64 IC22.13 | v76.2,40.64 v76.2,10.79
IBUS13  (via drill 0.3)  (1 unrouted)
  Top 0.254: IC14.13 104.14,8.26 103.5,8.89 85.09,8.89 84.45,9.53 IC7.7 v74.93,9.53 | v24.77,39.37 v74.93,39.37
  Bottom 0.254: IC22.14 24.77,52.07 v24.77,39.37 | v74.93,39.37 v74.93,9.53
IBUS14  (via drill 0.3)  (1 unrouted)
  Top 0.254: IC14.12 103.5,6.99 102.87,7.62 85.09,7.62 84.45,8.26 IC7.8 v78.11,8.26 | v23.5,41.27 v78.11,41.27
  Bottom 0.254: IC22.15 23.5,50.8 v23.5,41.27 | v78.11,41.27 v78.11,8.26
IBUS15  (via drill 0.3)  (1 unrouted)
  Top 0.254: IC7.9 v84.45,6.99 85.09,6.35 102.23,6.35 102.87,5.71 IC14.11 | v25.4,40.01 v75.56,40.01 | v75.56,8.89 v84.45,8.89
  Bottom 0.254: IC22.17 22.86,53.98 25.4,53.98 v25.4,40.01 | v75.56,40.01 v75.56,8.89 | v84.45,8.89 v84.45,6.99
IR0  (1 unrouted)
IR2  (1 unrouted)
ISROLL  (via drill 0.3)  (3 unrouted)
  Top 0.254: v17.78,38.73 116.84,38.73
  Bottom 0.254: IC22.19 17.78,53.98 v17.78,38.73
J  (1 unrouted)
K  (1 unrouted)
LJ  (1 unrouted)
LK  (1 unrouted)
LTOGGLE  (2 unrouted)
LTOGGLE0  (1 unrouted)
LTOGGLE1  (1 unrouted)
N$98  (1 unrouted)
N$341
  Bottom 0.254: LED1.A R6.2
ROLL16  (via drill 0.3)  (3 unrouted)
  Top 0.254: v26.04,38.1 116.84,38.1
  Bottom 0.254: IC22.18 26.04,55.88 v26.04,38.1
RUNIT0  (via drill 0.3)  (3 unrouted)
  Top 0.254: IC17.26 17.78,25.4 35.56,25.4 IC16.28 38.1,22.86 58.42,22.86 IC15.28
  Bottom 0.254: IC16.28 35.56,25.4 35.56,33.02 v31.75,36.83 | IC15.28 58.42,25.4 v58.42,35.56
RUNIT1  (via drill 0.3)  (3 unrouted)
  Top 0.254: IC15.29 55.88,27.94 35.56,27.94 IC16.29 33.66,26.04 v23.5,26.04
  Bottom 0.254: IC15.29 v57.15,40.01 | IC17.23 20.32,25.4 22.86,25.4 v23.5,26.04
RUNIT2  (1 unrouted)
RUNIT3  (1 unrouted)
UOP0  (via drill 0.3)  (1 unrouted)
  Top 0.254: IC20.3 55.88,56.52 v52.7,56.52 | v52.7,64.77 v30.48,64.77 13.34,64.77 IC22.29 | v30.48,56.52 33.02,56.52 IC21.3
  Bottom 0.254: v52.7,64.77 v52.7,56.52 | v30.48,64.77 v30.48,56.52
UOP1  (via drill 0.3)  (1 unrouted)
  Top 0.254: IC22.3 10.16,53.98 v5.71,53.98 | v5.71,65.41 v29.84,65.41 v52.07,65.41 | v52.07,55.24 IC20.2
  Bottom 0.254: v5.71,53.98 v5.71,65.41 | v29.84,65.41 29.84,55.24 IC21.2 | v52.07,65.41 v52.07,55.24
UOP2  (via drill 0.3)  (2 unrouted)
  Top 0.254: v6.35,55.24 IC22.2 | v6.35,66.04 v29.21,66.04 v51.44,66.04 | v29.21,60.33 IC21.30 | v51.44,60.33 IC20.30
  Bottom 0.254: v6.35,55.24 v6.35,66.04 | v29.21,66.04 v29.21,60.33 | v51.44,66.04 v51.44,60.33
VCC  (via drill 0.3)  (44 unrouted)
  Top 0.406: IC4.13 IC4.12
  Bottom 0.254: v88.9,32.38 88.9,34.29 C6.2
  pour Top (isolate 0.254, rank 6, no thermals): 0,99.69 0,-0.64 160.66,-0.64 160.66,99.69
Y0  (1 unrouted)
Y1  (via drill 0.3)
  Top 0.254: IC15.14 71.12,16.51 73.03,18.41 v104.14,18.41 | v104.14,29.84 IC13.3
  Bottom 0.254: v104.14,18.41 v104.14,29.84
Y2  (via drill 0.3)
  Top 0.254: v103.5,28.57 IC13.4 | v71.75,19.68 v103.5,19.68
  Bottom 0.254: IC15.15 68.58,17.78 71.75,17.78 v71.75,19.68 | v103.5,19.68 v103.5,28.57
Y3  (via drill 0.3)
  Top 0.254: v102.87,19.05 72.39,19.05 71.12,17.78 68.58,17.78 IC15.17 | v102.87,27.3 IC13.5
  Bottom 0.254: v102.87,19.05 v102.87,27.3
Y4  (via drill 0.3)
  Top 0.254: IC15.18 83.19,21.59 84.45,20.32 v102.23,20.32 | v102.23,26.04 IC13.6
  Bottom 0.254: v102.23,20.32 v102.23,26.04
Y5  (via drill 0.3)  (1 unrouted)
  Bottom 0.254: IC15.19 68.58,22.86 v68.58,25.4
Y6  (1 unrouted)
  Top 0.254: IC16.13 45.72,12.7 59.05,12.7 63.5,8.26 71.75,8.26
Y7  (via drill 0.3)
  Top 0.254: v50.8,33.66 71.12,33.66 74.93,37.47 v97.79,37.47 | v100.97,22.23 IC13.9
  Bottom 0.254: IC16.14 50.8,16.51 v50.8,33.66 | v100.97,22.23 97.79,25.4 v97.79,37.47
Y8  (via drill 0.3)
  Top 0.254: v50.16,33.02 71.75,33.02 75.56,36.83 v97.16,36.83 | v100.97,15.88 IC14.2
  Bottom 0.254: IC16.15 45.72,17.78 50.16,17.78 v50.16,33.02 | v100.97,15.88 100.97,19.68 97.16,23.5 v97.16,36.83
Y9  (via drill 0.3)
  Top 0.254: v49.53,32.38 72.39,32.38 76.2,36.2 v96.52,36.2 | v100.97,14.61 IC14.3
  Bottom 0.254: IC16.17 45.72,20.32 49.53,20.32 v49.53,32.38 | v100.97,14.61 100.33,15.24 100.33,19.05 96.52,22.86 v96.52,36.2
Y10  (via drill 0.3)
  Top 0.254: v48.9,31.75 73.03,31.75 76.83,35.56 v95.89,35.56 | v100.97,13.34 IC14.4
  Bottom 0.254: IC16.18 48.9,21.59 v48.9,31.75 | v100.97,13.34 99.69,14.61 99.69,18.41 95.89,22.23 v95.89,35.56
Y11  (via drill 0.3)
  Top 0.254: v48.26,31.11 73.66,31.11 77.47,34.92 v95.25,34.92 | v100.97,12.06 IC14.5
  Bottom 0.254: IC16.19 45.72,22.86 48.26,22.86 v48.26,31.11 | v100.97,12.06 99.06,13.97 99.06,17.78 95.25,21.59 v95.25,34.92
Y12  (via drill 0.3)
  Top 0.254: v100.97,10.79 IC14.6 | v27.3,30.48 74.3,30.48 78.11,34.29 v94.61,34.29
  Bottom 0.254: IC17.13 27.3,13.97 v27.3,30.48 | v100.97,10.79 98.42,13.34 98.42,17.14 94.61,20.95 v94.61,34.29
Y13  (via drill 0.3)
  Top 0.254: v100.97,9.53 IC14.7 | v93.98,33.66 78.74,33.66 74.93,29.84 v26.67,29.84
  Bottom 0.254: IC17.14 26.67,16.51 v26.67,29.84 | v100.97,9.53 97.79,12.7 97.79,16.51 93.98,20.32 v93.98,33.66
Y14  (via drill 0.3)
  Top 0.254: v100.97,8.26 IC14.8 | v93.34,33.02 79.38,33.02 75.56,29.21 v26.04,29.21
  Bottom 0.254: IC17.15 22.86,17.78 26.04,17.78 v26.04,29.21 | v100.97,8.26 97.16,12.06 97.16,15.88 93.34,19.68 v93.34,33.02
Y15  (via drill 0.3)
  Top 0.254: v100.97,6.99 IC14.9 | v92.71,31.11 92.08,31.75 79.38,31.75 76.2,28.57 v25.4,28.57
  Bottom 0.254: IC17.17 22.86,20.32 25.4,20.32 v25.4,28.57 | v100.97,6.99 96.52,11.43 96.52,15.24 92.71,19.05 v92.71,31.11